# Altium schematic sheet CAN.SchDoc: Apalis Evaluation Board 1.1
size A3; Organization: Toradex AG; Address1: Altsagenstrasse 5; Address2: Horw; Address3: 6048; Address4: Switzerland; DocumentNumber: 23; Revision: V1.1; SheetNumber: 23; SheetTotal: 32; PageSetup: Record=PageOptions|CenterHorizontal=True|CenterVertical=True|PrintScale=0.73|XCorrection=1.00|YCorrection=1.00|PrintKind=0|BorderSize=5000000|LeftOffset=0|BottomOffset=0|Orientation=2|PaperLength=1000|PaperWidth=1000|Scale=100|PaperSource=7|PrintQuality=-4|MediaType=1|DitherType=10|PaperKind=A4|PrintScaleMode=1
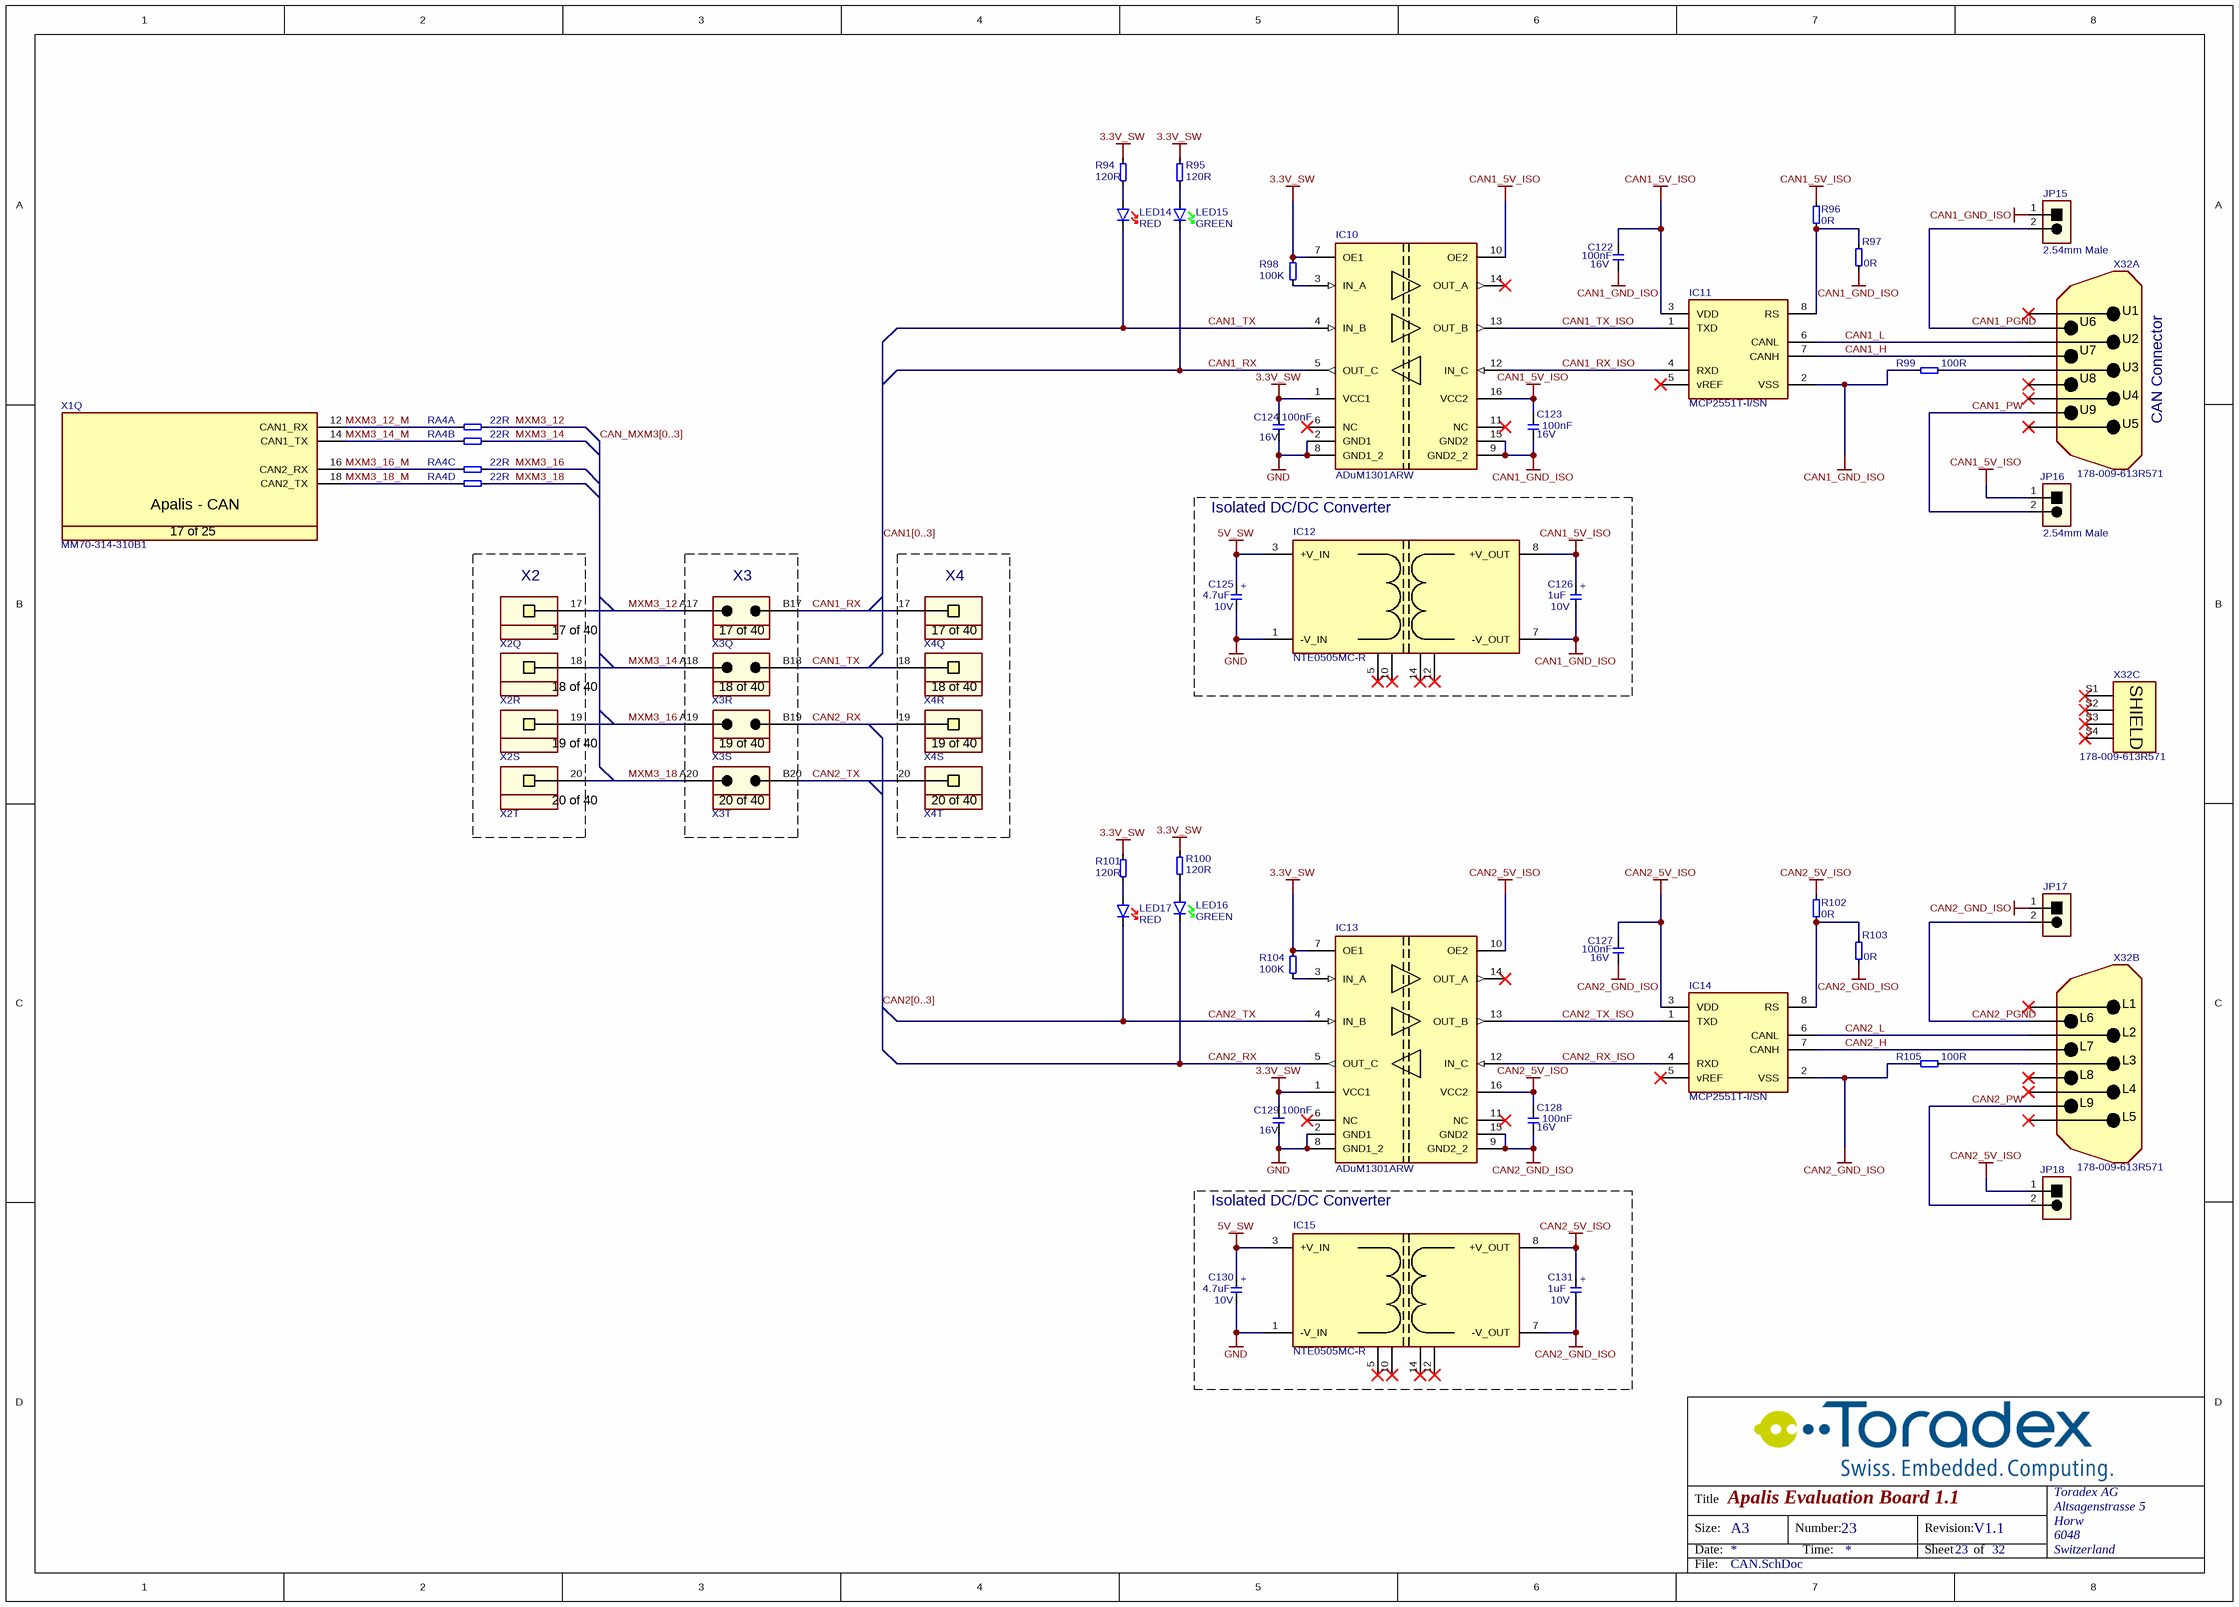
[diagram p0: CAN.SchDoc]

## Parts
C122  Rating: 16V  [T_CAPC0603X33N]  (hidden comment: 100nF)
C123  Rating: 16V  [T_CAPC0603X33N]  (hidden comment: 100nF)
C124  Rating: 16V  [T_CAPC0603X33N]  (hidden comment: 100nF)
C125  Rating: 10V  [T_CAPMP3216X180N]  (hidden comment: 4.7uF)
C126  Rating: 10V  [T_CAPMP3216X180N]  (hidden comment: 1uF)
C127  Rating: 16V  [T_CAPC0603X33N]  (hidden comment: 100nF)
C128  Rating: 16V  [T_CAPC0603X33N]  (hidden comment: 100nF)
C129  Rating: 16V  [T_CAPC0603X33N]  (hidden comment: 100nF)
C130  Rating: 10V  [T_CAPMP3216X180N]  (hidden comment: 4.7uF)
C131  Rating: 10V  [T_CAPMP3216X180N]  (hidden comment: 1uF)
IC10  ADuM1301ARW  [T_AD_ADuM1300ARW]
IC11  MCP2551T-I/SN  [SOIC127P600X173-8N]
IC12  NTE0505MC-R  [T_MURATA_NTE0505MC-R]
IC13  ADuM1301ARW  [T_AD_ADuM1300ARW]
IC14  MCP2551T-I/SN  [SOIC127P600X173-8N]
IC15  NTE0505MC-R  [T_MURATA_NTE0505MC-R]
JP15  TSW-101-07-G-D  [T_Samtec_TSW-101-07-G-D]  (value not drawn)
JP16  TSW-101-07-G-D  [T_Samtec_TSW-101-07-G-D]  (value not drawn)
JP17  TSW-101-07-G-D  [T_Samtec_TSW-101-07-G-D]  (value not drawn)
JP18  TSW-101-07-G-D  [T_Samtec_TSW-101-07-G-D]  (value not drawn)
LED14  Color: RED  [T_Osram_T670_RED]  (hidden comment: LS T670-K1L2-1)
LED15  Color: GREEN  [T_Osram_T670_GREEN]  (hidden comment: LG T670-K1L2-1)
LED16  Color: GREEN  [T_Osram_T670_GREEN]  (hidden comment: LG T670-K1L2-1)
LED17  Color: RED  [T_Osram_T670_RED]  (hidden comment: LS T670-K1L2-1)
R94  120R  [T_RESC0603X30N]
R95  120R  [T_RESC0603X30N]
R96  0R  [T_RESC0603X30N]
R97  0R  [T_RESC0603X30N]
R98  100K  [T_RESC0603X30N]
R99  100R  [T_RESC0603X30N]
R100  120R  [T_RESC0603X30N]
R101  120R  [T_RESC0603X30N]
R102  0R  [T_RESC0603X30N]
R103  0R  [T_RESC0603X30N]
R104  100K  [T_RESC0603X30N]
R105  100R  [T_RESC0603X30N]
RA4  22R  [T_Resistor_Array_X4]  (parts A,B,C,D of 4)
X1  Manufacturer Part No.: MM70-314-310B1  [T_JAE_MM70-314-310B1]  (hidden comment: CON-JAE-MM70-314-310B1-314-0.5mm)  (part Q of 25)
X2  SSW-110-01-G-S  [T_Samtec_SSW-110-01-G-S]  (value not drawn)  (parts Q,R,S,T of 40)
X3  TSW-110-07-G-D  [T_Samtec_TSW-110-07-G-D]  (value not drawn)  (parts Q,R,S,T of 40)
X4  SSW-110-01-G-S  [T_Samtec_SSW-110-01-G-S]  (value not drawn)  (parts Q,R,S,T of 40)
X32  178-009-613R571  [T_NorComp_178-YYY-613R691]  (parts A,B,C of 3)

## Blocks framed on the sheet
Isolated DC/DC Converter: C125 C126 IC12
X2: X2
X3: X3
X4: X4
Isolated DC/DC Converter: C130 C131 IC15

## Nets
3.3V_SW: C124.2 C129.2 IC10.1(VCC1) IC10.7(OE1) IC13.1(VCC1) IC13.7(OE1) R94.1 R95.1 R98.2 R100.1 R101.1 R104.2
5V_SW: C125.1 C130.1 IC12.3(+V_IN) IC15.3(+V_IN)
CAN1_5V_ISO: C122.2 C123.2 C126.1 IC10.10(OE2) IC10.16(VCC2) IC11.3(VDD) IC12.8(+V_OUT) JP16.1 R96.2
CAN1_GND_ISO: C122.1 C123.1 C126.2 IC10.9(GND2_2) IC10.15(GND2) IC11.2(VSS) IC12.7(-V_OUT) JP15.1 R97.1 R99.2
CAN2_5V_ISO: C127.2 C128.2 C131.1 IC13.10(OE2) IC13.16(VCC2) IC14.3(VDD) IC15.8(+V_OUT) JP18.1 R102.2
CAN2_GND_ISO: C127.1 C128.1 C131.2 IC13.9(GND2_2) IC13.15(GND2) IC14.2(VSS) IC15.7(-V_OUT) JP17.1 R103.1 R105.2
GND: C124.1 C125.2 C129.1 C130.2 IC10.2(GND1) IC10.8(GND1_2) IC12.1(-V_IN) IC13.2(GND1) IC13.8(GND1_2) IC15.1(-V_IN)
CAN1_H: IC11.7(CANH) X32.U7(RTS)
CAN1_L: IC11.6(CANL) X32.U2(RXD)
CAN1_PGND: JP15.2 X32.U6(DSR)
CAN1_PW: JP16.2 X32.U9(RI)
CAN1_RX: IC10.5(OUT_C) LED15.K X3.B17 X4.17
CAN1_RX_ISO: IC10.12(IN_C) IC11.4(RXD)
CAN1_TX: IC10.4(IN_B) LED14.K X3.B18 X4.18
CAN1_TX_ISO: IC10.13(OUT_B) IC11.1(TXD)
CAN2_H: IC14.7(CANH) X32.L7(RTS)
CAN2_L: IC14.6(CANL) X32.L2(RXD)
CAN2_PGND: JP17.2 X32.L6(DSR)
CAN2_PW: JP18.2 X32.L9(RI)
CAN2_RX: IC13.5(OUT_C) LED16.K X3.B19 X4.19
CAN2_RX_ISO: IC13.12(IN_C) IC14.4(RXD)
CAN2_TX: IC13.4(IN_B) LED17.K X3.B20 X4.20
CAN2_TX_ISO: IC13.13(OUT_B) IC14.1(TXD)
MXM3_12: RA4.5 X2.17 X3.A17
MXM3_12_M: RA4.1 X1.12(CAN1_RX)
MXM3_14: RA4.6 X2.18 X3.A18
MXM3_14_M: RA4.2 X1.14(CAN1_TX)
MXM3_16: RA4.7 X2.19 X3.A19
MXM3_16_M: RA4.3 X1.16(CAN2_RX)
MXM3_18: RA4.8 X2.20 X3.A20
MXM3_18_M: RA4.4 X1.18(CAN2_TX)
NetIC10_3: IC10.3(IN_A) R98.1
NetIC11_8: IC11.8(RS) R96.1 R97.2
NetIC13_3: IC13.3(IN_A) R104.1
NetIC14_8: IC14.8(RS) R102.1 R103.2
NetLED14_A: LED14.A R94.2
NetLED15_A: LED15.A R95.2
NetLED16_A: LED16.A R100.2
NetLED17_A: LED17.A R101.2
NetR99_1: R99.1 X32.U3(TXD)
NetR105_1: R105.1 X32.L3(TXD)

Not connected (* = marked no-connect by the designer): IC10 6(NC)* 11(NC)* 14(OUT_A)*; IC11 5(vREF)*; IC12 5(NC)* 10(NC)* 12(NC)* 14(NC)*; IC13 6(NC)* 11(NC)* 14(OUT_A)*; IC14 5(vREF)*; IC15 5(NC)* 10(NC)* 12(NC)* 14(NC)*; X32 L1(DCD)* L4(DTR)* L5(GND)* L8(CTS)* S1(SHIELD)* S2(SHIELD)* S3(SHIELD)* S4(SHIELD)* U1(DCD)* U4(DTR)* U5(GND)* U8(CTS)*

## Buses and harness runs
bus CAN1[0..3]
bus CAN2[0..3]
bus CAN_MXM3[0..3]

## Notes on the sheet
- (near JP15) 2.54mm Male
- CAN Connector
- (near JP16) 2.54mm Male
- Title
- Size:
- Date:
- A3
- Number:
- Time:
- Revision:
- Sheet
- of
- File:
- (in symbol C-TA-1uF-10V-20%-3216) +
- (in symbol C-TA-4.7uF-10V-20%-3216) +
- (in symbol CON-JAE-MM70-314-310B1-314-0.5mm, part Q) Apalis - CAN; 17 of 25
- (in symbol CON-Samtec-SSW-110-01-G-S, part Q) 17 of 40
- (in symbol CON-Samtec-SSW-110-01-G-S, part R) 18 of 40
- (in symbol CON-Samtec-SSW-110-01-G-S, part S) 19 of 40
- (in symbol CON-Samtec-SSW-110-01-G-S, part T) 20 of 40
- (in symbol CON-Samtec-TSW-110-07-G-D, part Q) 17 of 40
- (in symbol CON-Samtec-TSW-110-07-G-D, part R) 18 of 40
- (in symbol CON-Samtec-TSW-110-07-G-D, part S) 19 of 40
- (in symbol CON-Samtec-TSW-110-07-G-D, part T) 20 of 40

## Library data of the parts
C122-C124 C127-C129 = C-X7R-100nF-16V-10%-0603: Capacitor Ceramic X7R 100nF 16V 10% 0603; Tolerance: 10%; Type: X7R; Value: 100nF
C125 C130 = C-TA-4.7uF-10V-20%-3216: Capacitor TA 4.7uF 10V 20% 3216; Tolerance: 20%; Type: TA; Value: 4.7uF
C126 C131 = C-TA-1uF-10V-20%-3216: Capacitor TA 1uF 10V 20% 3216; Tolerance: 20%; Type: TA; Value: 1uF
IC10 IC13 = IC-AD-ADuM1301ARW: Digital Isolator; Manufacturer Name: Analog Devices; Manufacturer Part No.: ADuM1301ARW
IC11 IC14 = IC-MC-MCP2551T-I/SN: High speed CAN Transceiver; Manufacturer Name: Microchip; Manufacturer Part No.: MCP2551T-I/SN
IC12 IC15 = IC-MUR-NTE0505MC-R: Isolated DC/DC Converter; Manufacturer Name: Murata; Manufacturer Part No.: NTE0505MC-R
JP15-JP18 = CON-Samtec-TSW-101-07-G-D: Header male, 1x2 Pins, 2.54 mm pitch; Manufacturer Name: Samtec; Pitch: 2.54 mm; No. of ways: 1x2; Manufacturer Part no.: TSW-101-07-G-D
LED14 LED17 = LED-Osram-LS T670-K1L2-1: LED red, Osram LS T670-K1L2-1; Manufacturer Name: Osram; Manufacturer Part No.: LS T670-K1L2-1
LED15 LED16 = LED-Osram-T670-K1L2-1: LED green Osram LG T670-K1L2-1; Manufacturer Name: Osram; Manufacturer Part No.: LG T670-K1L2-1
R94 R95 R100 R101 = R-120R-63mW-5%-0603: Resistor 120 ohm 63mW 5% 0603; Rating: 63mW; Tolerance: 5%; Value: 120R
R96 R97 R102 R103 = R-0R-63mW-1%-0603: Resistor 0 ohm 63mW 1% 0603; Rating: 63mW; Tolerance: 1%; Value: 0R
R98 R104 = R-100KR-63mW-5%-0603: Resistor 100 Kohm 63mW 5% 0603; Value: 100KR; Rating: 63mW; Tolerance: 5%
R99 R105 = R-100R-63mW-5%-0603: Resistor 100 ohm 63mW 5% 0603; Rating: 63mW; Tolerance: 5%; Value: 100R
RA4 = RA-22R-63mW-5%-1206-div: Resistor Array 22 R 63mW 5% 1206; Tolerance: 5%; Power Dissipation: 63mW; Value: 22R
X1 = CON-JAE-MM70-314-310B1-314-0.5mm: MXM3 Connector; Manufacturer Name: JAE; No. of ways: 314
X2 X4 = CON-Samtec-SSW-110-01-G-S: Receptacle Female Socket 1x40 pin 2.54mm pitch; Manufacturer Name: Samtec; Pitch: 2.54mm; No. of ways: 1x40; Manufacturer Part No.: SSW-110-01-G-S
X3 = CON-Samtec-TSW-110-07-G-D: Header 2x40 pin 2.54mm pitch; Manufacturer Name: Samtec; Pitch: 2.54mm; No. of ways: 2x40; Manufacturer Part No.: TSW-110-07-G-D
X32 = CON-NorComp-178-009-613R571: RS232 Connector 9 pins male; No. of Ways: 18; Manufacturer Name: NorComp; Manufacturer Part No.: 178-009-613R571